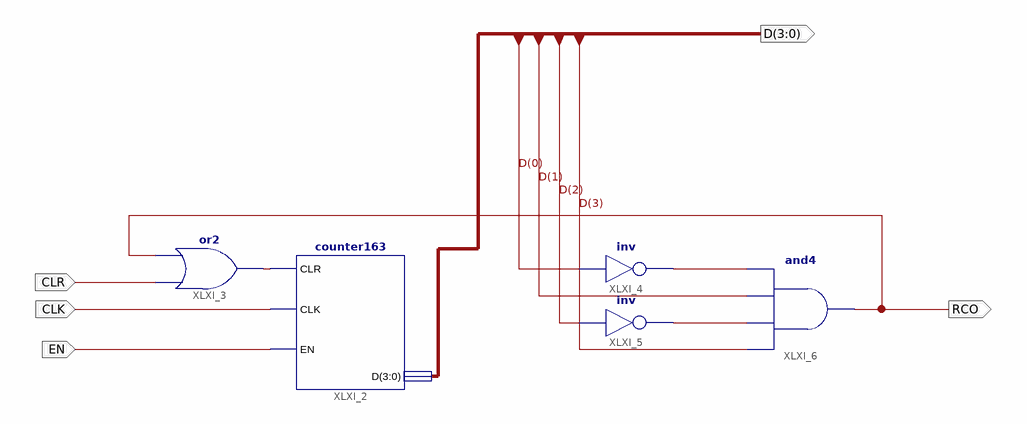
[diagram p0: schematic sheet 1]
// Xilinx ISE schematic mod10.sch (spartan3e) as structural Verilog: 5 symbols, 5 ports
module mod10 (
  input  CLK,
  input  CLR,
  input  EN,
  output RCO,
  output [3:0] D
);

  wire XLXN_1, XLXN_7, XLXN_8;

  counter163 XLXI_2 (.CLR(XLXN_1), .CLK(CLK), .EN(EN), .D(D));
  or XLXI_3 (XLXN_1, CLR, RCO);
  not XLXI_4 (XLXN_7, D[0]);
  not XLXI_5 (XLXN_8, D[2]);
  and XLXI_6 (RCO, D[3], XLXN_8, D[1], XLXN_7);
endmodule
